# Altium project ARDUINO_SHIELD.PrjPcb
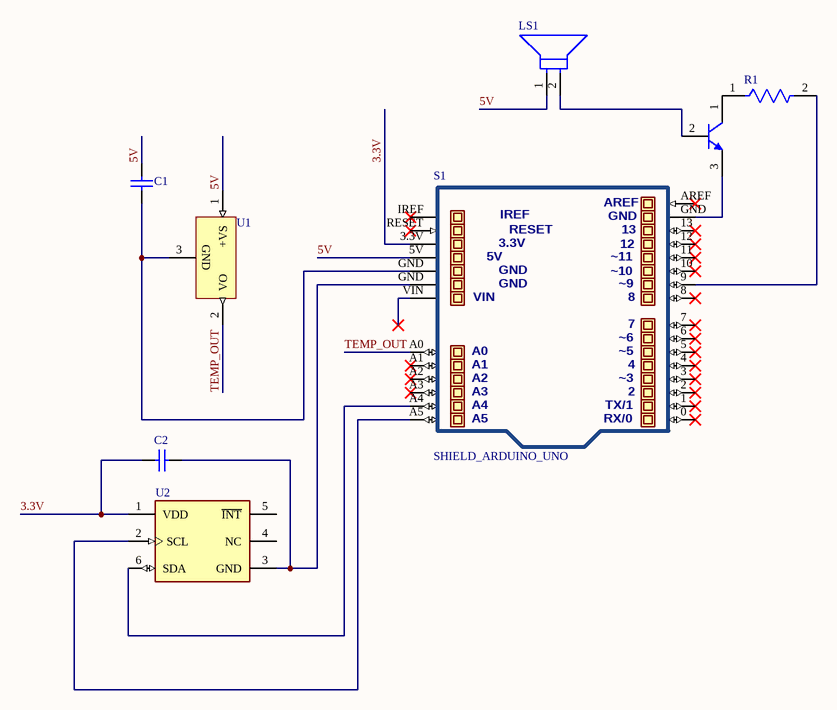
[diagram p0: SHIELD_ARDUINO_UNO.SchDoc]
1 sheet, 8 parts. Net scope: global (net labels, ports and power ports of the same name join across sheets).

## Sheet SHIELD_ARDUINO_UNO.SchDoc
size A; SheetNumber: 1; SheetTotal: 1

### Parts
?  BC547B  [ONSC-TO-92-3-29-11]  (value not drawn)
C1  CC0603ZRY5V9BB104  [CAPC1608X90X40LL10T20]  (value not drawn)
C2  CC0603ZRY5V9BB104  [CAPC1608X90X40LL10T20]  (value not drawn)
LS1  AT-1224-TWT-5V-2-R  [FP-AT-1224-TWT-5V-2-R-MFG]  (value not drawn)
R1  RP73D2B1K0BTDF  [FP-RP732B-MFG]  (value not drawn)
S1  SHIELD_ARDUINO_UNO  [SHIELD_ARDUINO]
U1  LM35DZ/NOPB  [LP0003A]  (value not drawn)
U2  TCS34725FN  [FP-TCS34725FN-MFG]  (value not drawn)

### Nets
3.3V: C2.1 S1.3.3V U2.1(VDD)
5V: C1.2 LS1.1(C) S1.5V U1.1(+VS)
TEMP_OUT: S1.A0 U1.2(VO)
Net?_1: ?.1(C) R1.1
Net?_2: ?.2(B) LS1.2(A)
Net?_3: ?.3(E) S1.GND
NetC1_1: C1.1 S1.GND U1.3(GND)
NetC2_2: C2.2 S1.GND U2.3(GND)
NetR1_2: R1.2 S1.9
NetS1_A4: S1.A4 U2.6(SDA)
NetS1_A5: S1.A5 U2.2(SCL)

Not connected (* = marked no-connect by the designer): S1 0* 1* 2* 3* 4* 5* 6* 7* 8* 10* 11* 12* 13* A1* A2* A3* AREF* IREF(6)* RESET(5)* VIN*; U2 4(NC) 5(~{INT})

### Notes on the sheet
- (in symbol SHIELD_ARDUINO_UNO) ~11; ~10; ~9; ~6; ~5; ~3; TX/1; RX/0

### Library data of the parts
? = CMP-1048-01467-1: Amplifier Transistor, NPN Silicon, 3-Pin TO-92, Bulk Box; Manufacturer: On Semiconductor; IC Continuous (A): 0.1; fT Min (MHz): 150; DatasheetVersion: Rev. 7; ComponentLink1URL: http://www.onsemi.com/; Polarity: NPN; RoHS: FALSE; ComponentLink1Description: Manufacturer URL; Packing: Bulk Box; PackageDescription: 3-Pin Transistor Outline, Body 4.825 x 3.685 mm, Pitch 1.27 mm; ComponentLink3URL: http://www.onsemi.cn/pub_link/Collateral/2N6426-D.PDF; ComponentLink2Description: Datasheet; PackageVersion: Rev. AM; PackageReference: TO-92-3-29-11_AM_SL; ComponentLink3Description: Package Specification; Mounting Technology: Through Hole; PartNumber: BC547B; ComponentLink2URL: http://www.onsemi.com/pub_link/Collateral/BC546-D.PDF
C1 C2 = CMP-1035-02594-2: Chip Capacitor, 100 nF, - 20% to + 80%, 50 V, -30 to 85 degC, 0603 (1608 Metric), RoHS, Tape and Reel; Manufacturer: Yageo; Tolerance: -20%,+80%; Capacitance: 0.1µF; Product Training Modules: MultilayerCeramicCapacitors; Temperature Coefficient: Y5V(F); Kits: CC060300000000000-ND-MLCC0603SAMPLEKIT; Other Names: 311-1343-1; Featured Product: CommodityMultilayerCeramicCapacitors–CCSeries; Online Catalog: CCSeries; Voltage - Rated: 50V; Mounting Type: SurfaceMount,MLCC; Package Description: 2-Pin Surface Mount Device, Body 1.6 x 0.8 mm; Ratings: -; Lead Spacing: -; Standard Package: 1; Applications: GeneralPurpose; Size / Dimension: 0.063"Lx0.031"W(1.60mmx0.80mm); Package Reference: 0603; Operating Temperature: -30°C~85°C; Features: -; Height - Seated (Max): -; Thickness (Max): 0.035"(0.90mm); Series: CC; Datasheet URL: https://datasheet.ciiva.com/17434/upy-gphc-y5v-6-3v-to-50v-5-17434523.pdf; Family: CeramicCapacitors; Mounting Technology: SurfaceMount; Packaging: CutTape(CT); Package / Case: 0603(1608Metric); Manufacturer URL: http://www.yageo.com/; Category: Capacitors; Lead Style: -; Datasheet Version: Rev. 5, 07/2010
LS1 = CMP-231722-000001-1: BUZZER MAGNETIC 5V 12MM TH; Operating Supply Current: 40mA; Frequency: 2.4kHz; Min Operating Temperature: -30°C; Voltage Rating: 5V; Mount: Through Hole; Diameter: 12mm; Termination: PC Pins; Max Operating Temperature: 70°C; Contact Plating: Tin; Height: 9mm; Series: AT; Max Supply Current: 40mA; Sensing Method: Magnetic; Packaging: Tray
R1 = CMP-03211-010976-1: Res Thin Film 1206 1.0KΩ 0.1% 0.25W 15ppm/°C Molded SMD; Manufacturer: TE Connectivity; Voltage Rating: 200V; Lead Free: Yes; RoHS: TRUE; Category: Res; Tolerance: 0.1%; Octopart: https://octopart.com/rp73d2b1k0btdf-te+connectivity-22741139; packaging: 1000 Reel; Device Class L2: Resistors; Power Rating: 0.25W; Value: 1.0KΩ; Device Class L1: Passive Components; Device Class L3: Chip SMD Resistors; Temperature Range Low: -55°C; Package: RP732B; Series: RP73; Height: 0.65mm; Composition: Thin Film; Temperature Range High: 155°C; Automotive: No; Temperature Coefficient: 15ppm/°C; octopart_url: https://octopart.com/rp73d2b1k0btdf-te+connectivity-22741139; Temperature: -55°C to 155°C; Ipc Land Pattern Name: RESC305155X55; ComponentLink2Description: Datasheet; Resistance: 1.0KΩ; Manufacturer Part Number: RP73D2B1K0BTDF; ComponentLink2URL: https://www.te.com/commerce/DocumentDelivery/DDEController?Action=showdoc&DocId=Data+Sheet%7F1773272%7FL%7Fpdf%7FEnglish%7FENG_DS_1773272_L.pdf%7F8-1879255-6
U1 = CMP-0066-00030-3: Precision Centigrade Temperature Sensor, 3-pin TO-92, Pb-Free; Manufacturer: Texas Instruments; PowerWise: N; PackageTopMarking: NSXYTT*LM35*DZ; CompType: Temp Sensor IC; RoHS: Y; PackageReference: LP0003A; PinCount: 3; ComponentLink1URL: http://www.ti.com/general/docs/lit/getliterature.tsp?genericPartNumber=LM35&fileType=pdf; Code_JEDEC: TO-226-AA; PackageDescription: TO-92, Molded, 3 Lead; ComponentLink1Description: Datasheet URL
U2 = CMP-0550-00051-3: IC COLOR CONV LIGHT-DGTL 6-DFN; Interface: I2C; Sensing Method: Optical; Max Supply Voltage: 3.6V; Max Supply Current: 330uA; Resolution: 16b; Operating Supply Voltage: 3.3V; Min Supply Voltage: 2.7V; Wavelength: 525nm; Max Frequency: 400kHz; Lead Free: Lead Free; Max Operating Temperature: 70°C; Packaging: Tape and Reel; Number of Pins: 6; Width: 2.4mm; Package Quantity: 1; Length: 2mm; Case/Package: SMD/SMT; Min Operating Temperature: -30°C; Height: 0.65mm